# EAGLE schematic Adafruit Feather 32u4 Bluefruit LE (EAGLE 9.6.2)
COMPANY: ADAFRUIT INDUSTRIES; DRAWN: KTOWN; REV: B
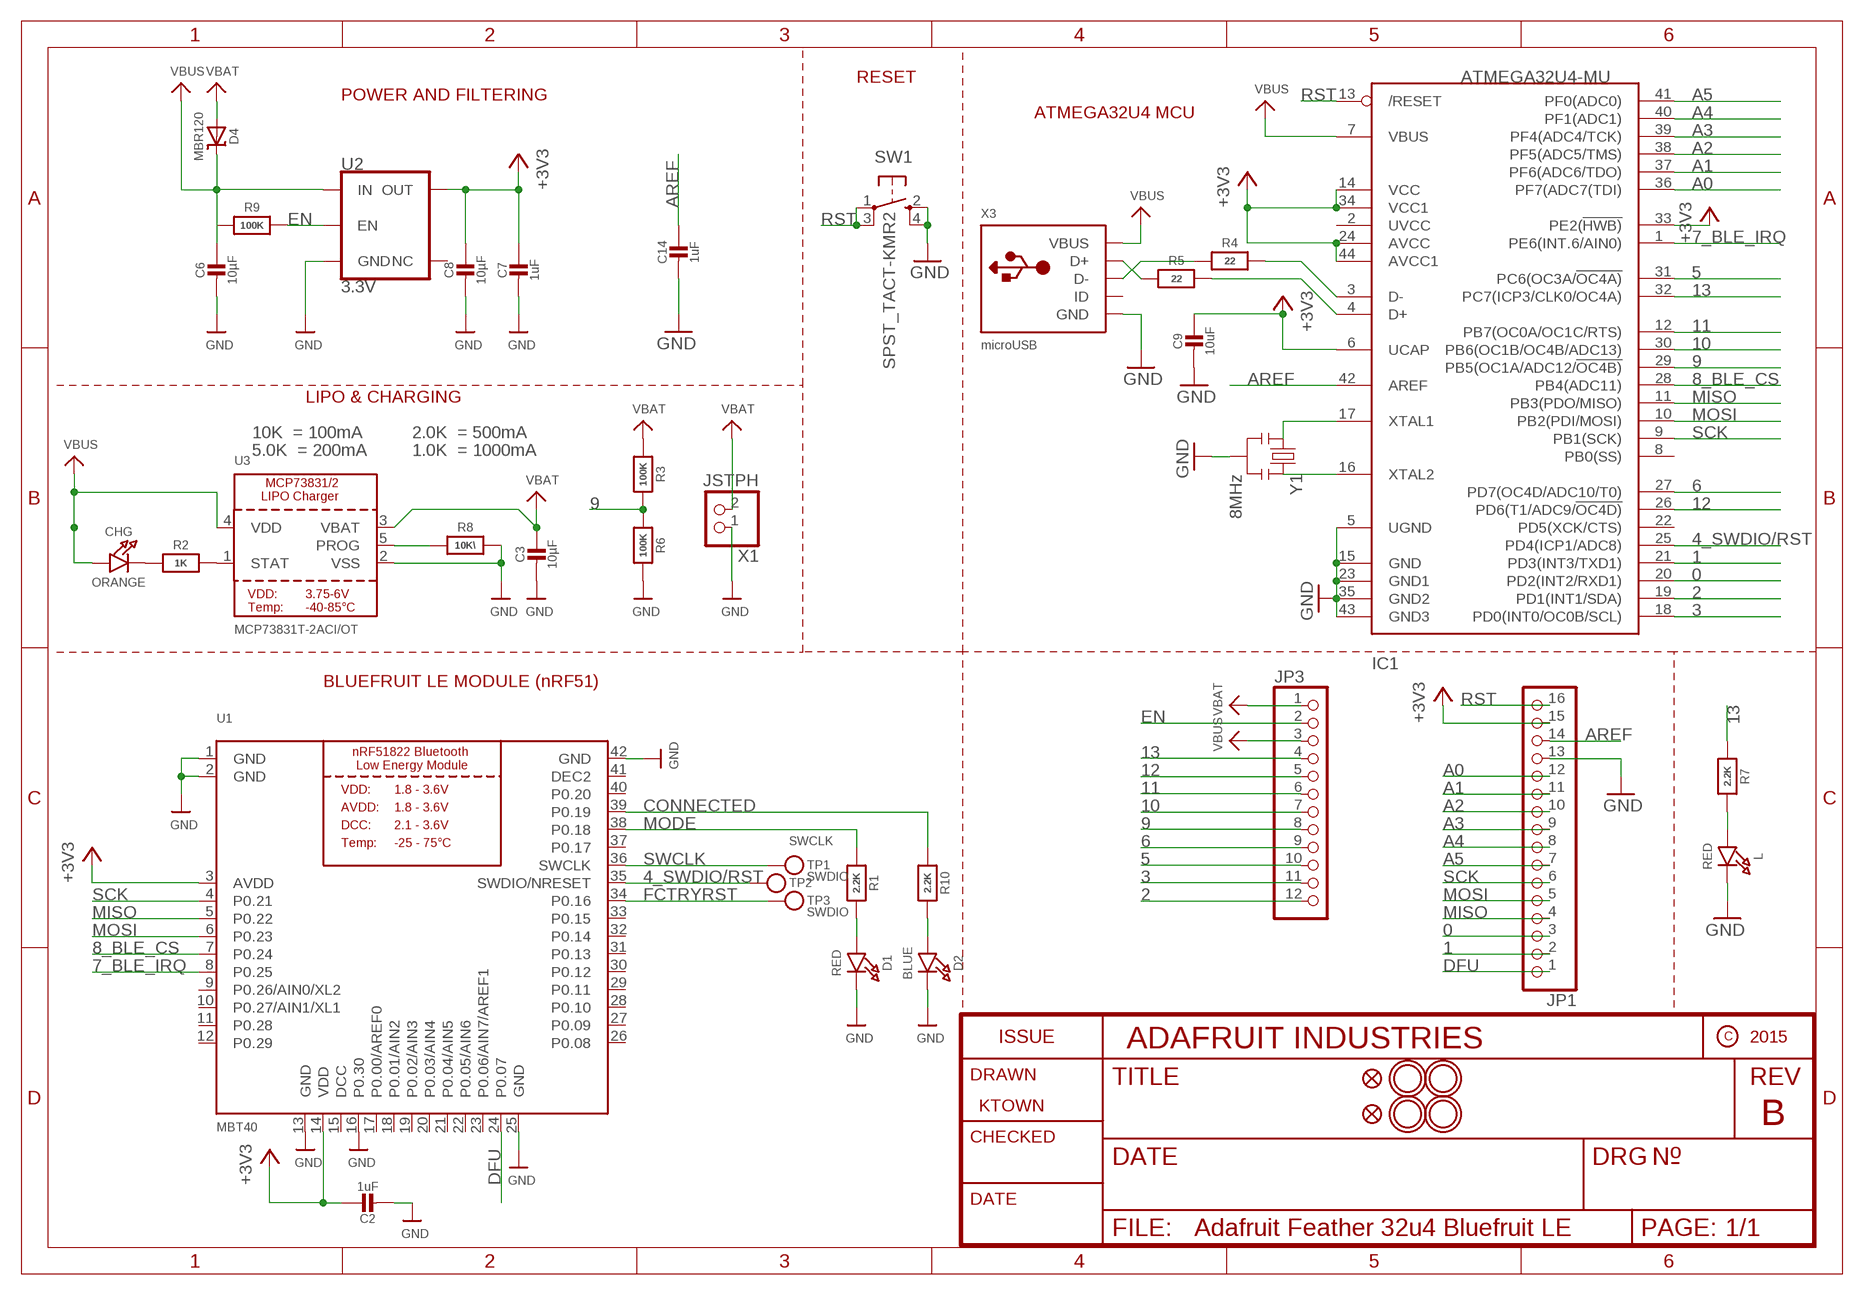
[diagram p0: schematic, sheet 1]

## Parts
C2  1uF  CAP_CERAMIC0603_NO  [0603-NO]
C3  10µF  CAP_CERAMIC0805-NOOUTLINE  [0805-NO]
C6  10µF  CAP_CERAMIC0805-NOOUTLINE  [0805-NO]
C7  1uF  CAP_CERAMIC0603_NO  [0603-NO]
C8  10µF  CAP_CERAMIC0805-NOOUTLINE  [0805-NO]
C9  10uF  CAP_CERAMIC_0805MP  [_0805MP]
C14  1uF  CAP_CERAMIC0603_NO  [0603-NO]
CHG  ORANGE  LED0805_NOOUTLINE  [CHIPLED_0805_NOOUTLINE]
D1  RED  LED0805_NOOUTLINE  [CHIPLED_0805_NOOUTLINE]
D2  BLUE  LED0805_NOOUTLINE  [CHIPLED_0805_NOOUTLINE]
D4  MBR120  DIODE-SCHOTTKYSOD-123  [SOD-123]
IC1  ATMEGA32U4-MU  [TQFN44_7MM]
JP1  HEADER-1X16ROUND  [1X16_ROUND]
JP3  HEADER-1X12  [1X12_ROUND]
L  RED  LED0805_NOOUTLINE  [CHIPLED_0805_NOOUTLINE]
R1  2.2K  RESISTOR_0603_NOOUT  [0603-NO]
R2  1K  RESISTOR_0603_NOOUT  [0603-NO]
R3  100K  RESISTOR_0603_NOOUT  [0603-NO]
R4  22  RESISTOR_0603_NOOUT  [0603-NO]
R5  22  RESISTOR_0603_NOOUT  [0603-NO]
R6  100K  RESISTOR_0603_NOOUT  [0603-NO]
R7  2.2K  RESISTOR_0603_NOOUT  [0603-NO]
R8  10K\  RESISTOR_0603_NOOUT  [0603-NO]
R9  100K  RESISTOR_0603_NOOUT  [0603-NO]
R10  2.2K  RESISTOR_0603_NOOUT  [0603-NO]
SW1  SPST_TACT-KMR2  [KMR2]
TP1  SWCLK  TESTPOINT1.5X2.0MM_NOCREAM  [PAD-1.5X2.0]
TP2  SWDIO  TESTPOINT1.5X2.0MM_NOCREAM  [PAD-1.5X2.0]
TP3  SWDIO  TESTPOINT1.5X2.0MM_NOCREAM  [PAD-1.5X2.0]
U1  MBT40  NRF51822_MODULE_MDBT40  [BLE_MODULE_RAYTAC_MDBT40]
U2  3.3V  V_REG_AP2112K-3.3V  [SOT23-5]
U3  MCP73831T-2ACI/OT  MCP73831/2  [SOT23-5]
U$6  MOUNTINGHOLE2.5  [MOUNTINGHOLE_2.5_PLATED]
U$24  MOUNTINGHOLE2.5  [MOUNTINGHOLE_2.5_PLATED]
U$31  MOUNTINGHOLE2.5  [MOUNTINGHOLE_2.5_PLATED]
U$32  MOUNTINGHOLE2.5  [MOUNTINGHOLE_2.5_PLATED]
U$34  FIDUCIAL""  [FIDUCIAL_1MM]
U$35  FIDUCIAL""  [FIDUCIAL_1MM]
X1  JSTPH  CON_JST_PH_2PIN  [JSTPH2]
X3  microUSB  USB_MICRO_20329_V2  [4UCONN_20329_V2]
Y1  8MHz  RESONATORSMD  [RESONATOR-SMD]

## Nets
0: IC1.20(PD2(INT2/RXD1)) JP1.3
1: IC1.21(PD3(INT3/TXD1)) JP1.2
2: IC1.19(PD1(INT1/SDA)) JP3.12
3: IC1.18(PD0(INT0/OC0B/SCL)) JP3.11
4_SWDIO/RST: IC1.25(PD4(ICP1/ADC8)) TP2.P$1 U1.35(SWDIO/NRESET)
5: IC1.31(PC6(OC3A/!OC4A)) JP3.10
6: IC1.27(PD7(OC4D/ADC10/T0)) JP3.9
7_BLE_IRQ: IC1.1(PE6(INT.6/AIN0)) U1.8(P0.25)
8_BLE_CS: IC1.28(PB4(ADC11)) U1.7(P0.24)
9: IC1.29(PB5(OC1A/ADC12/!OC4B)) JP3.8 R3.2 R6.1
10: IC1.30(PB6(OC1B/OC4B/ADC13)) JP3.7
11: IC1.12(PB7(OC0A/OC1C/RTS)) JP3.6
12: IC1.26(PD6(T1/ADC9/!OC4D)) JP3.5
13: IC1.32(PC7(ICP3/CLK0/OC4A)) JP3.4 R7.1
+3V3: C2.1 C7.1 C8.1 C9.1 IC1.6(UCAP) IC1.14(VCC) IC1.24(AVCC) IC1.33(PE2(!HWB)) IC1.34(VCC1) IC1.44(AVCC1) JP1.15 U1.3(AVDD) U1.14(VDD) U2.5(OUT)
A0: IC1.36(PF7(ADC7(TDI)) JP1.12
A1: IC1.37(PF6(ADC6/TDO)) JP1.11
A2: IC1.38(PF5(ADC5/TMS)) JP1.10
A3: IC1.39(PF4(ADC4/TCK)) JP1.9
A4: IC1.40(PF1(ADC1)) JP1.8
A5: IC1.41(PF0(ADC0)) JP1.7
AREF: C14.1 IC1.42(AREF) JP1.14
CONNECTED: R10.1 U1.39(P0.19)
D+: IC1.4(D+) R5.2
D-: IC1.3(D-) R4.2
DFU: JP1.1 U1.24(P0.07)
EN: JP3.2 R9.2 U2.3(EN)
FCTRYRST: TP3.P$1 U1.34(P0.16)
GND: C2.2 C3.2 C6.2 C7.2 C8.2 C9.2 C14.2 D1.C D2.C IC1.5(UGND) IC1.15(GND) IC1.23(GND1) IC1.35(GND2) IC1.43(GND3) JP1.13 L.C R6.2 R8.2 SW1.2(S) SW1.4(S1) U1.1(GND) U1.2(GND) U1.13(GND) U1.16(P0.30) U1.25(GND) U1.42(GND) U2.2(GND) U3.2(VSS) X1.1 X3.BASE@1(GND) X3.BASE@2(GND) X3.GND X3.SPRT@1(GND) X3.SPRT@2(GND) X3.SPRT@3(GND) X3.SPRT@4(GND) Y1.2
MISO: IC1.11(PB3(PDO/MISO)) JP1.4 U1.5(P0.22)
MODE: R1.1 U1.38(P0.18)
MOSI: IC1.10(PB2(PDI/MOSI)) JP1.5 U1.6(P0.23)
N$1: CHG.C R2.1
N$2: L.A R7.2
N$3: R2.2 U3.1(STAT)
N$4: R8.1 U3.5(PROG)
N$5: D1.A R1.2
N$6: D2.A R10.2
N$11: IC1.16(XTAL2) Y1.3
N$12: IC1.17(XTAL1) Y1.1
N$15: R5.1 X3.D+
N$16: R4.1 X3.D-
RST: IC1.13(/RESET) JP1.16 SW1.1(P) SW1.3(P1)
SCK: IC1.9(PB1(SCK)) JP1.6 U1.4(P0.21)
SWCLK: TP1.P$1 U1.36(SWCLK)
VBAT: C3.1 D4.A JP3.1 R3.1 U3.3(VBAT) X1.2
VBUS: C6.1 CHG.A D4.C IC1.7(VBUS) JP3.3 R9.1 U2.1(IN) U3.4(VDD) X3.VBUS
Unconnected: IC1.2(UVCC) IC1.8(PB0(SS)) IC1.22(PD5(XCK/CTS)) U1.9(P0.26/AIN0/XL2) U1.10(P0.27/AIN1/XL1) U1.11(P0.28) U1.12(P0.29) U1.17(P0.00/AREF0) U1.18(P0.01/AIN2) U1.19(P0.02/AIN3) U1.20(P0.03/AIN4) U1.21(P0.04/AIN5) U1.22(P0.05/AIN6) U1.23(P0.06/AIN7/AREF1) U1.26(P0.08) U1.27(P0.09) U1.28(P0.10) U1.29(P0.11) U1.30(P0.12) U1.31(P0.13) U1.32(P0.14) U1.33(P0.15) U1.37(P0.17) U1.40(P0.20) U2.4(NC) X3.ID

## Notes on the sheet
- RESET
- POWER AND FILTERING
- ATMEGA32U4 MCU
- LIPO & CHARGING
- 10K  = 100mA | 2.0K  = 500mA
- 5.0K  = 200mA | 1.0K  = 1000mA
- BLUEFRUIT LE MODULE (nRF51)

## Power pins joined to a net without a drawn wire
DCC: U1.15(DCC)
DEC2: U1.41(DEC2)

## Library data of the parts
C2 C3 C6-C9 C14 = microbuilder:CAP_CERAMIC: Ceramic Capacitors For new designs, use the packages preceded by an '_' character since they are more reliable: The following footprints should be used on most boards: _0402 - Standard footprint for regular board layouts _0603 - Standard footprint for regular board layouts _0805 - Standard footprint for regular board layouts _1206 - Standard footprint for regular board layouts For extremely tight-pitch boards where space is at a premium, the following 'micro-pitch' footprints can be used (smaller pads, no silkscreen outline, etc.): _0402MP - Micro-pitch footprint for very dense/compact boards _0603MP - Micro-pitch footprint for very dense/compact boards _0805MP - Micro-pitch footprint for very dense/compact boards _1206MP - Micro-pitch footprint for very dense/compact boards
CHG D1 D2 L = microbuilder:LED: LED 0603 - 0603 Surface Mount Package 2mA: Green LED - Low Power (3.9mcd, 2ma, 1.7Vf) - Digikey: 475-2709-2-ND Orange LED - Low Power (9.8mcd, 2ma, 1.8Vf) - Digikey: 475-1194-2-ND Red LED - Low Power (5mcd, 2ma, 1.8Vf) - Digikey: 475-1195-2-ND Yellow LED - Low Power (7mcd, 2ma, 1.8Vf) - Digikey: 475-1196-2-ND 5mA: Blue LED - Low Power (17mcd, 5ma, 2.9Vf) - Digikey: LNJ937W8CRACT-ND 0805 - 0805 Surface Mount Package 2mA: Red LED (8.8mcd, 2mA, 1.8Vf, Clear) - Low Power [Digikey: 475-2510-1-ND] Green LED (5mcd, 2mA, 1.8Vf, Clear) - Low Power [Digikey: 475-2730-1-ND] Yellow LED (11.3mcd, 2mA, 1.8Vf, Clear) - Low Power [Digikey: 475-2555-1-ND] 20mA: Red LED (104mcd, 20mA, Diffused) - LS R976 [Digikey: 475-1278-6-ND] Red LED (12mcd, 20mA, 2.0Vf, Clear) - APT2012EC [Digikey: 754-1128-1-ND] Green LED (15mcd, 20mA, 2.2Vf, Clear) - APT2012GC [Digikey: 754-1131-1-ND] Orange LED (160mcd, 20mA, 2.1Vf, Clear) - APT2012SECK [Digikey: 754-1130-1-ND] 1206 - 1206 Surface Mount Package Green LED (26mcd, 20mA, Diffused) - LG N971 [Digikey: 475-1407-6-ND] Red LED (15mcd, 20mA, Diffused) - LH N974 [Digikey: 475-1416-6-ND] Cree - Cree High-Power Surface Mount LEDs XPEBWT-L1-0000-00D50 - White 111lm 350mA 2.9Vf 6200K 110° XTEAWT-00-0000-00000LEE3 - White 114lm 350mA 2.85Vf 5000K 115° Everlight - Everlight 45-21 Series Surface Mount LEDs 45-21/QK2C-B2832AC2CB2/2T - Warm White 2000mcd 20mA 3.25Vf 3050K 120° 45-21/LK2C-B38452C4CB2/2T - Nuetral White 2000mcd 20mA 3.25Vf 4150K 120° 45-21/LK2C-B50634C6CB2/2T - Cold White 2200mcd 20mA 3.25Vf 5650K 120° PLCC2 Reverse Mount LS T77K-J1L2-1-0-2-R18-Z - Red 11.25mcd 2mA 1.8Vf 630nm 120° LO T77K-L1M2-24-Z - Orange 19.6mcd 2mA 1.8Vf 606nm 120° LY T77K-K2M1-26-Z - Yellow 15.7mcd 2mA 1.8Vf 587nm 120°
D4 = microbuilder:DIODE-SCHOTTKY
IC1 = microbuilder:ATMEGA32U4: http://www.ladyada.net/library/eagle
JP1 = microbuilder:HEADER-1X16: PIN HEADER
JP3 = microbuilder:HEADER-1X12
R1-R10 = microbuilder:RESISTOR: Resistors For new designs, use the packages preceded by an '_' character since they are more reliable: The following footprints should be used on most boards: _0402 - Standard footprint for regular board layouts _0603 - Standard footprint for regular board layouts _0805 - Standard footprint for regular board layouts _1206 - Standard footprint for regular board layouts For extremely tight-pitch boards where space is at a premium, the following 'micro-pitch' footprints can be used (smaller pads, no silkscreen outline, etc.): _0402MP - Micro-pitch footprint for very dense/compact boards _0603MP - Micro-pitch footprint for very dense/compact boards _0805MP - Micro-pitch footprint for very dense/compact boards _1206MP - Micro-pitch footprint for very dense/compact boards
SW1 = adafruit:SPST_TACT: SMT 6mm switch, EVQQ2 series http://www.ladyada.net/library/eagle
TP1-TP3 = microbuilder:TESTPOINT: Test Point Various test points for characterisation and PCB testing TESTPOINT_SMT - Compact Surface Mount Test Point [Digikey: 5016KTR-ND]
U1 = microbuilder:NRF51822_MODULE_MDBT40: nRF51822 Bluetooth Low Energy Module
U2 = SparkFun-IC-Power:V_REG_AP2112: AP2112 - 600mA CMOS LDO Regulator w/ Enable The AP2112 is CMOS process low dropout linear regulator with enable function, the regulator delivers a guaranteed 600mA (min.) continuous load current. Features Output Voltage Accuracy: ±1.5% Output Current: 600mA (Min.) Foldback Short Current Protection: 50mA Enable Function to Turn ON/OFF VOUT Low Dropout Voltage (3.3V): 250mV (Typ.) @IOUT=600mA Excellent Load Regulation: 0.2%/A (Typ.) Excellent Line Regulation: 0.02%/V (Typ.) Low Quiescent Current: 55μA (Typ.) Low Standby Current: 0.01μA (Typ.) Low Output Noise: 50μVRMS PSRR: 100Hz -65dB, 1kHz -65dB OTSD Protection Stable with 1.0μF Flexible Cap: Ceramic, Tantalum and Aluminum Electrolytic Operation Temperature Range: -40°C to 85°C ESD: MM 400V, HBM 4000V; PROD_ID: VREG-12457
U3 = microbuilder:MCP73831/2: MCP73831/2 LIPO Charger VDD: 3.75 - 6V Temp -40 - 85°C Programmable Charge Rate: 15-500mA NOTE: STAT is a tri-state logic output on the MCP73831 and an open-drain output on the MCP73832. SOT23-5 with 4.2V output and tri-state logic on STAT = MCP73831T-2ACI/OT
U$6 U$24 U$31 U$32 = microbuilder:MOUNTINGHOLE: Mounting Hole For #2 screws (0.086"/2.18mm width, 0.094"/2.4mm hole) use 2.5mm; BOM: EXCLUDE
U$34 U$35 = microbuilder:FIDUCIAL: Fiducial Alignment Points Various fiducial points for machine vision alignment.; BOM: EXCLUDE
X1 = microbuilder:CON_JST_PH_2PIN: JST 2-Pin Right-Angle Connector PH-Series - 4UConnector: 17311 SH-Series - 4UConnector: 07278
X3 = microbuilder:USB: USB Connectors USBMINIB - Surface Mount Female Mini-B USB Connector 4UConnector: 06564
Y1 = SparkFun:RESONATOR: Resonator Small SMD resonator. This is the itty bitty 10/20MHz resonators with built in caps. CSTCE10M0G55 and CSTCE20M0V53. Footprint has been reviewed closely but hasn't been tested yet.